# Altium schematic sheet FPGA1394-Test.SchDoc
size A
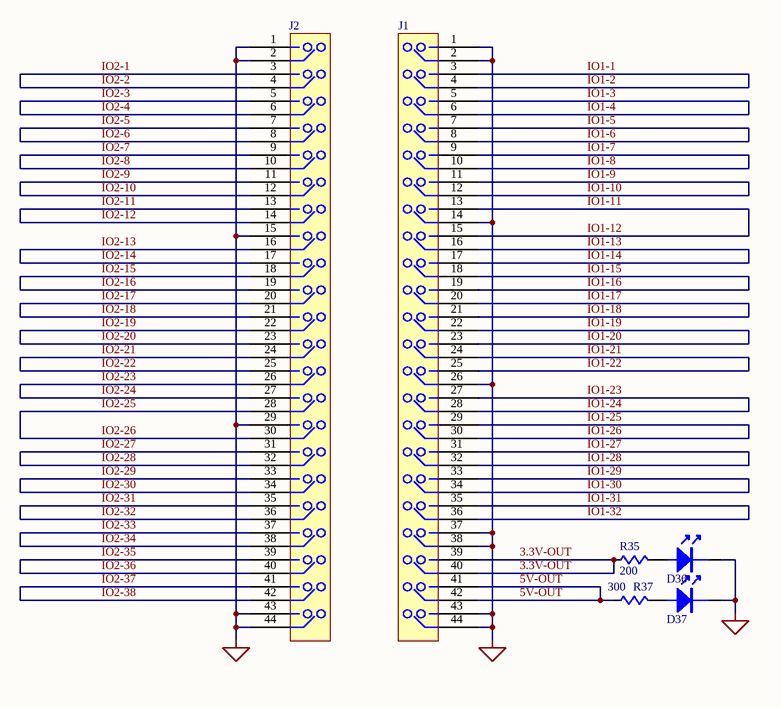
[diagram p0: FPGA1394-Test.SchDoc]

## Parts
D36  LED  [LED-0805]  (value not drawn)
D37  LED  [LED-0805]  (value not drawn)
J1  HEADER 22x2-1  [HDR-22x2-2MM]  (value not drawn)
J2  HEADER 22x2-1  [HDR-22x2-2MM]  (value not drawn)
R35  200  [R0805]
R37  300  [R0805]

## Nets
GND: D36.1(C) D37.1(C) J1.1 J1.2 J1.14 J1.26 J1.37 J1.38 J1.43 J1.44 J2.1 J2.2 J2.15 J2.29 J2.43 J2.44
3.3V-OUT: J1.39 J1.40 R35.1
5V-OUT: J1.41 J1.42 R37.1
IO1-1: J1.3 J1.4  [also labelled IO1-2]
IO1-3: J1.5 J1.6  [also labelled IO1-4]
IO1-5: J1.7 J1.8  [also labelled IO1-6]
IO1-7: J1.9 J1.10  [also labelled IO1-8]
IO1-10: J1.11 J1.12  [also labelled IO1-9]
IO1-11: J1.13 J1.15  [also labelled IO1-12]
IO1-13: J1.16 J1.17  [also labelled IO1-14]
IO1-15: J1.18 J1.19  [also labelled IO1-16]
IO1-17: J1.20 J1.21  [also labelled IO1-18]
IO1-19: J1.22 J1.23  [also labelled IO1-20]
IO1-21: J1.24 J1.25  [also labelled IO1-22]
IO1-23: J1.27 J1.28  [also labelled IO1-24]
IO1-25: J1.29 J1.30  [also labelled IO1-26]
IO1-27: J1.31 J1.32  [also labelled IO1-28]
IO1-29: J1.33 J1.34  [also labelled IO1-30]
IO1-31: J1.35 J1.36  [also labelled IO1-32]
IO2-1: J2.3 J2.4  [also labelled IO2-2]
IO2-3: J2.5 J2.6  [also labelled IO2-4]
IO2-5: J2.7 J2.8  [also labelled IO2-6]
IO2-7: J2.9 J2.10  [also labelled IO2-8]
IO2-10: J2.11 J2.12  [also labelled IO2-9]
IO2-11: J2.13 J2.14  [also labelled IO2-12]
IO2-13: J2.16 J2.17  [also labelled IO2-14]
IO2-15: J2.18 J2.19  [also labelled IO2-16]
IO2-17: J2.20 J2.21  [also labelled IO2-18]
IO2-19: J2.22 J2.23  [also labelled IO2-20]
IO2-21: J2.24 J2.25  [also labelled IO2-22]
IO2-23: J2.26 J2.27  [also labelled IO2-24]
IO2-25: J2.28 J2.30  [also labelled IO2-26]
IO2-27: J2.31 J2.32  [also labelled IO2-28]
IO2-29: J2.33 J2.34  [also labelled IO2-30]
IO2-31: J2.35 J2.36  [also labelled IO2-32]
IO2-33: J2.37 J2.38  [also labelled IO2-34]
IO2-35: J2.39 J2.40  [also labelled IO2-36]
IO2-37: J2.41 J2.42  [also labelled IO2-38]
NetD36_2: D36.2(A) R35.2
NetD37_2: D37.2(A) R37.2

## Library data of the parts
R35 R37 = R-MINI